# EasyEDA Pro project ProProject_AmaizeTrack.epro, schematic AmaizeSchematic_2

## Sheets
1 Schematic P1: Create Date: 2024-07-06; Page Name: Schematic P1; Project Name: AmaizeTrack; Schematic Name: AmaizeSchematic_2; Update Date: 2024-07-06; Company: AMAIZE; Drawed: Amaize; Page Size: A4; Part Number: #0001; Reviewed: Amaize; Version: V1.0
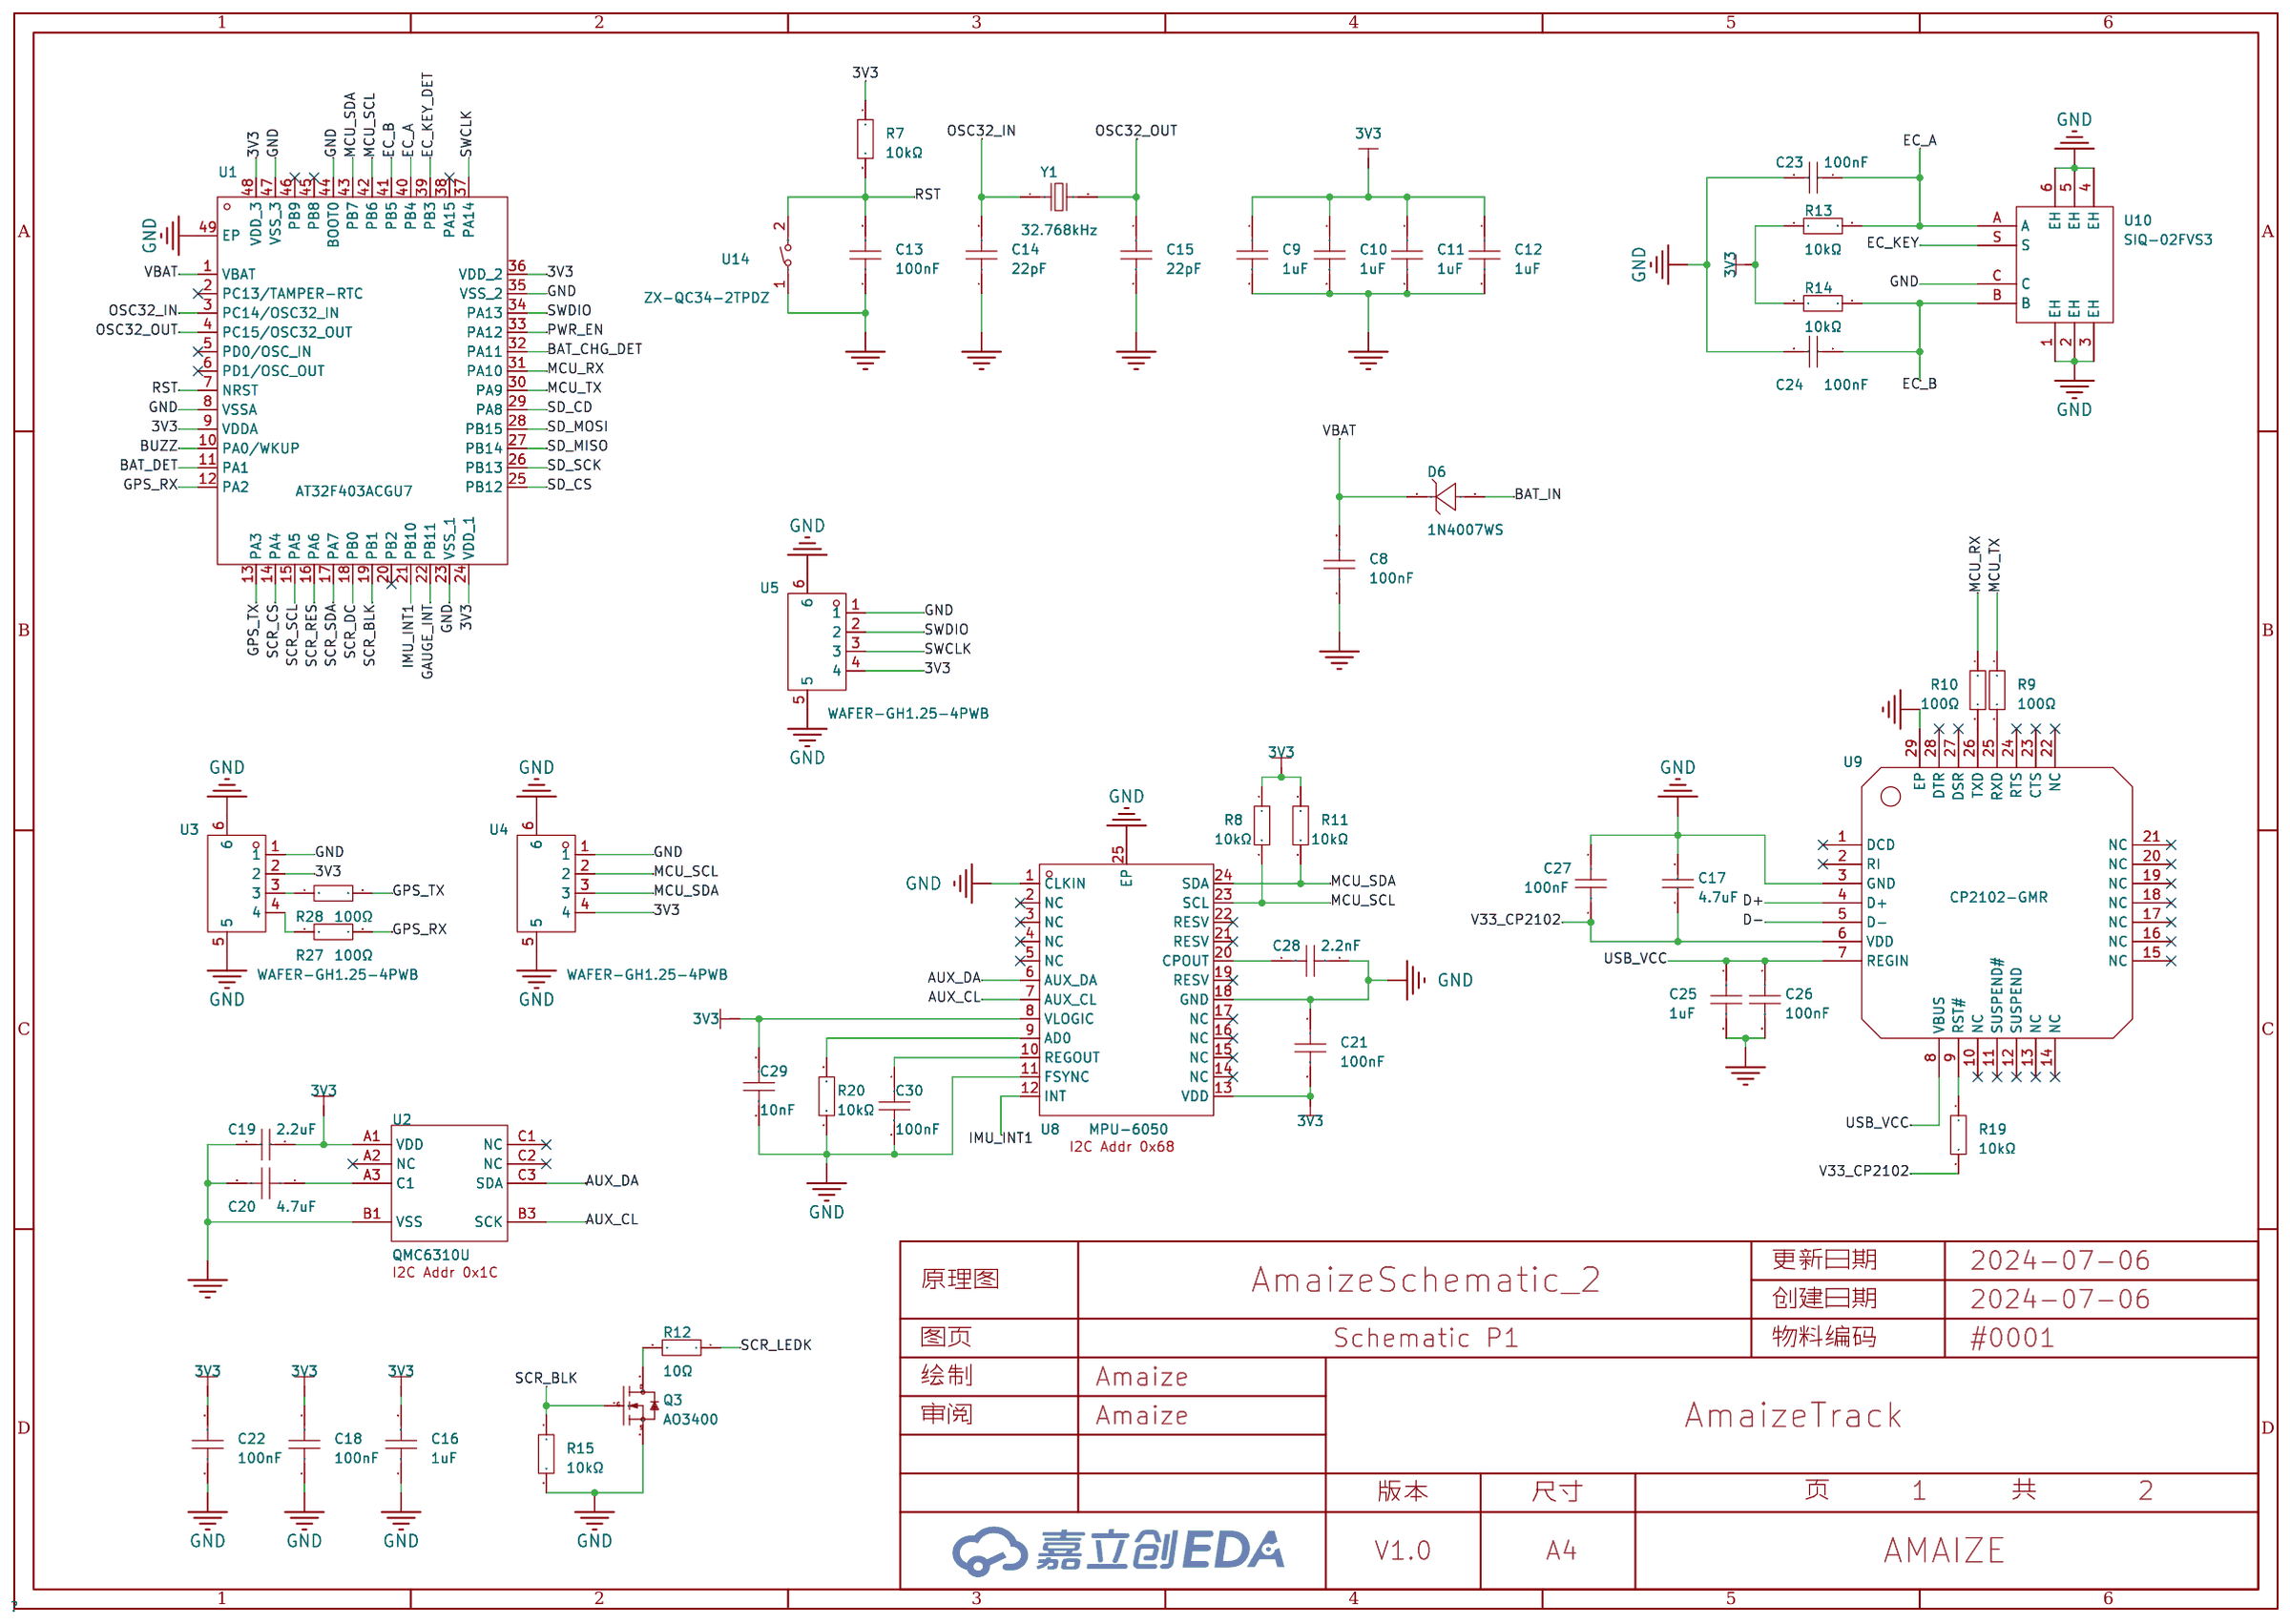
[diagram p2: Schematic P1]
2 Schematic P2: Page Name: Schematic P2; Company: Amaize; Version: 1.0
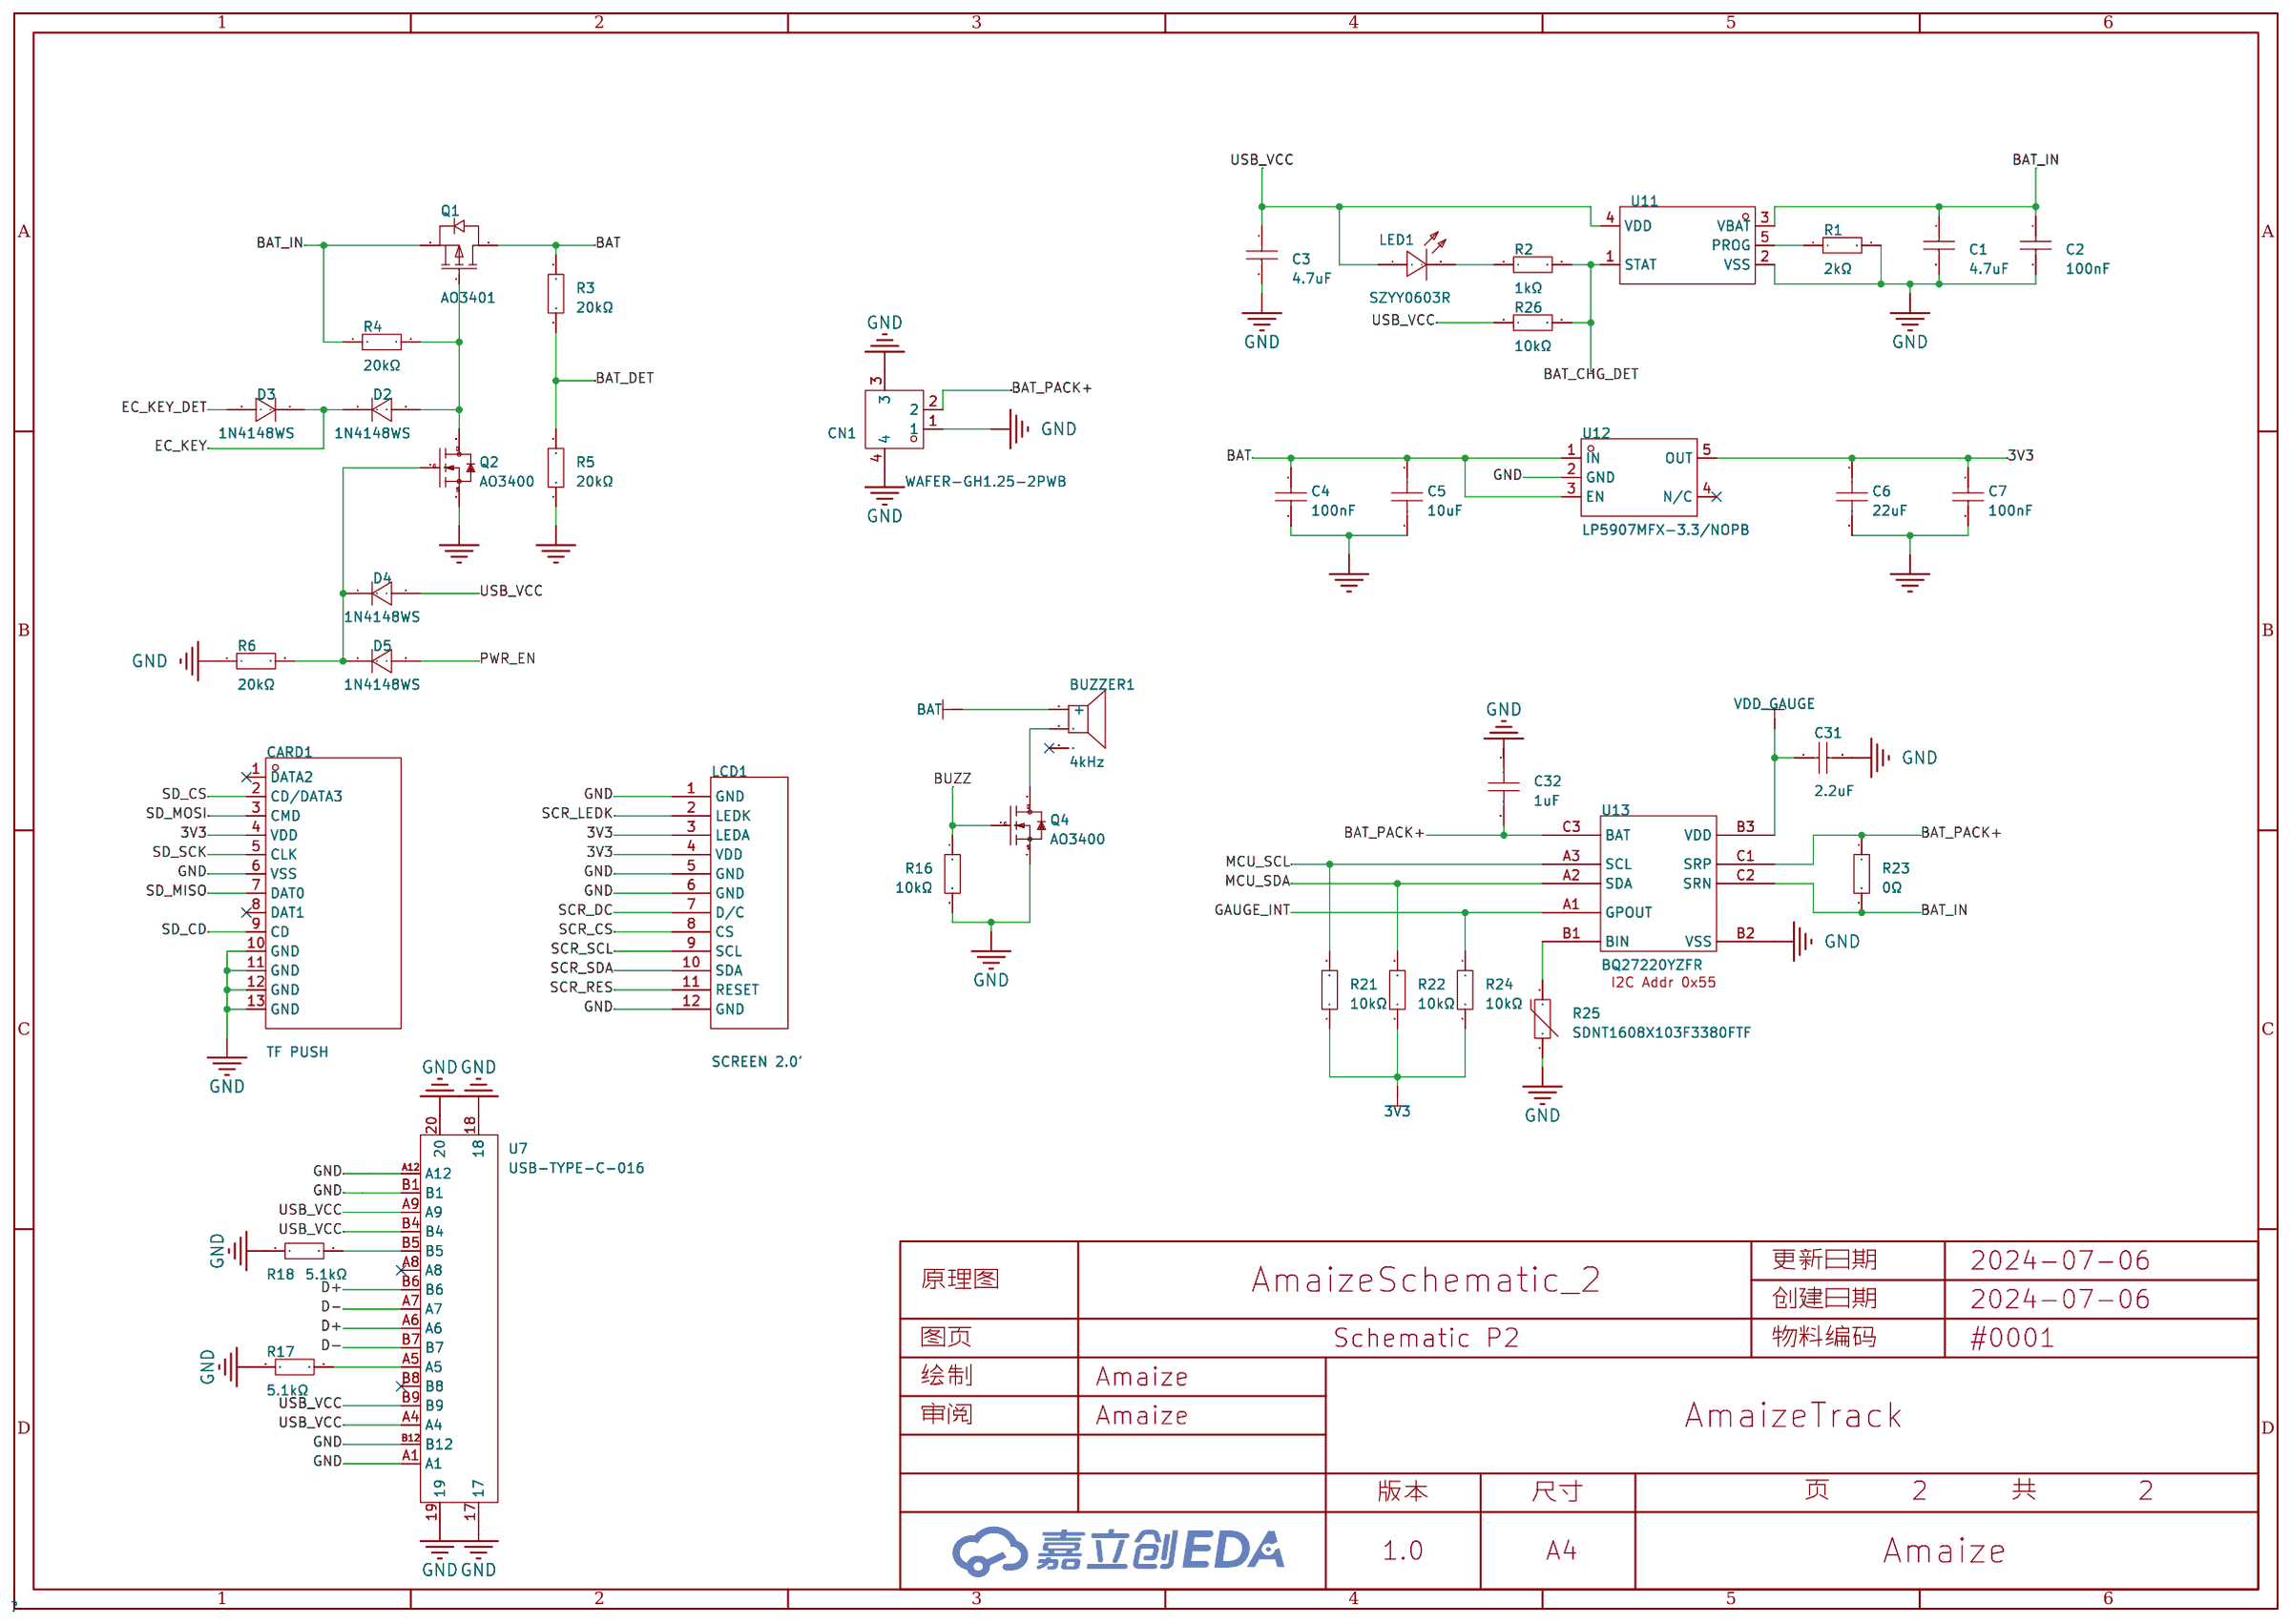
[diagram p3: Schematic P2]

## Parts
sheet Schematic P1
C8  100nF  [C0603]
C9  1uF  [C0603]
C10  1uF  [C0603]
C11  1uF  [C0603]
C12  1uF  [C0603]
C13  100nF  [C0603]
C14  22pF  [C0603]
C15  22pF  [C0603]
C16  1uF  [C0603]
C17  4.7uF  [C0603]
C18  100nF  [C0603]
C19  2.2uF  [C0603]
C20  4.7uF  [C0603]
C21  100nF  [C0603]
C22  100nF  [C0603]
C23  100nF  [C0603]
C24  100nF  [C0603]
C25  1uF  [C0603]
C26  100nF  [C0603]
C27  100nF  [C0603]
C28  2.2nF  [C0603]
C29  10nF  [C0603]
C30  100nF  [C0603]
D6  1N4007WS  [SOD-323_L1.8-W1.3-LS2.5-RD]
Q3  AO3400  [SOT-23-3_L2.9-W1.3-P1.90-LS2.4-BR]
R7  10kΩ  [R0603]
R8  10kΩ  [R0603]
R9  100Ω  [R0603]
R10  100Ω  [R0603]
R11  10kΩ  [R0603]
R12  10Ω  [R0603]
R13  10kΩ  [R0603]
R14  10kΩ  [R0603]
R15  10kΩ  [R0603]
R19  10kΩ  [R0603]
R20  10kΩ  [R0603]
R27  100Ω  [R0603]
R28  100Ω  [R0603]
U1  AT32F403ACGU7  [QFN-48_L6.0-W6.0-P0.40-BL-EP4.2]
U2  QMC6310U  [LGA-8_L1.2-W1.2-P0.40-R3-C3-TL]
U3  WAFER-GH1.25-4PWB  [CONN-SMD_4P-P1.25_XUNPU_WAFER-GH1.25-4PWB]
U4  WAFER-GH1.25-4PWB  [CONN-SMD_4P-P1.25_XUNPU_WAFER-GH1.25-4PWB]
U5  WAFER-GH1.25-4PWB  [CONN-SMD_4P-P1.25_XUNPU_WAFER-GH1.25-4PWB]
U8  MPU-6050  [QFN-24_L4.0-W4.0-P0.50-BL-EP2.7]
U9  CP2102-GMR  [WQFN-28_L5.0-W5.0-P0.50-BL-EP3.2]
U10  SIQ-02FVS3  [SW-SMD_SIQ-02FVS3_1]
U14  ZX-QC34-2TPDZ  [KEY-SMD_L3.9-W3.0-LS5.0-EH]
Y1  32.768kHz  [FC-135R_L3.2-W1.5]
sheet Schematic P2
BUZZER1  4kHz  [BUZ-SMD_FST-5030]
C1  4.7uF  [C0603]
C2  100nF  [C0603]
C3  4.7uF  [C0603]
C4  100nF  [C0603]
C5  10uF  [C0603]
C6  22uF  [C1206]
C7  100nF  [C0603]
C31  2.2uF  [C0603]
C32  1uF  [C0603]
CARD1  TF PUSH  [TF-SMD_TF-PUSH]
CN1  WAFER-GH1.25-2PWB  [CONN-TH_2P-P1.25_XUNPU_WAFER-GH1.25-2PWB]
D2  1N4148WS  [SOD-323_L1.8-W1.3-LS2.5-RD]
D3  1N4148WS  [SOD-323_L1.8-W1.3-LS2.5-RD]
D4  1N4148WS  [SOD-323_L1.8-W1.3-LS2.5-RD]
D5  1N4148WS  [SOD-323_L1.8-W1.3-LS2.5-RD]
LCD1  SCREEN 2.0'  [SCREEN 2.0' 12PIN]
LED1  SZYY0603R  [LED0603-R-RD]
Q1  AO3401  [SOT-23-3_L2.9-W1.4-P1.90-LS2.6-BR]
Q2  AO3400  [SOT-23-3_L2.9-W1.3-P1.90-LS2.4-BR]
Q4  AO3400  [SOT-23-3_L2.9-W1.3-P1.90-LS2.4-BR]
R1  2kΩ  [R0603]
R2  1kΩ  [R0603]
R3  20kΩ  [R0603]
R4  20kΩ  [R0603]
R5  20kΩ  [R0603]
R6  20kΩ  [R0603]
R16  10kΩ  [R0603]
R17  5.1kΩ  [R0603]
R18  5.1kΩ  [R0603]
R21  10kΩ  [R0603]
R22  10kΩ  [R0603]
R23  0Ω  [R2512]
R24  10kΩ  [R0603]
R25  SDNT1608X103F3380FTF  [R0603]
R26  10kΩ  [R0603]
U7  USB-TYPE-C-016  [USB-SMD_TYPE-C16PCB1.6073]
U11  MCP73831T-2ACI/OT  [SOT-23-5_L3.0-W1.7-P0.95-LS2.8-BL]
U12  LP5907MFX-3.3/NOPB  [SOT-23-5_L3.0-W1.7-P0.95-LS2.8-BR]
U13  BQ27220YZFR  [DSBGA-9_L1.7-W1.6-R3-C3-P0.50-BL]

## Library data of the parts
C2 C4 C7 C8 C13 C18 C21-C24 C26 C27 C30 = CC0603KRX7R9BB104: 容值:100nF;精度:±10%;额定电压:50V;材质(温度系数):X7R;; LCSC Part Name: 100nF ±10% 50V; Supplier Part: C14663; Manufacturer: YAGEO(国巨); Supplier Footprint: 0603; JLCPCB Part Class: Basic Part; Datasheet: https://atta.szlcsc.com/upload/public/pdf/source/20180910/C282072_33301C7F631E79921B82A8DAC6BCC5B3.pdf; Supplier: LCSC; Tolerance: ±10%; Voltage Rated: 50V; Temperature Coefficient: X7R
C9-C12 C16 C25 C32 = CC0603KRX5R9BB105: 容值:1uF;精度:±10%;额定电压:50V;材质(温度系数):X5R;; LCSC Part Name: 1uF ±10% 50V; Supplier Part: C128624; Manufacturer: YAGEO(国巨); Supplier Footprint: 0603; JLCPCB Part Class: Extended Part; Datasheet: https://atta.szlcsc.com/upload/public/pdf/source/20200814/C576840_DA45DE962A74012E2DAEDF1935E384ED.pdf; Supplier: LCSC; Tolerance: ±10%; Voltage Rated: 50V; Temperature Coefficient: X5R
C14 C15 = CC0603JRNPO9BN220: 容值:22pF;精度:±5%;额定电压:50V;材质(温度系数):NP0;; LCSC Part Name: 22pF ±5% 50V; Supplier Part: C105620; Manufacturer: YAGEO(国巨); Supplier Footprint: 0603; JLCPCB Part Class: Extended Part; Datasheet: https://atta.szlcsc.com/upload/public/pdf/source/20170505/1493957838062.pdf; Supplier: LCSC; Tolerance: ±5%; Voltage Rated: 50V; Temperature Coefficient: NP0
C1 C3 C17 C20 = CC0603KRX5R7BB475: 容值:4.7uF;精度:±10%;额定电压:16V;材质(温度系数):X5R;; LCSC Part Name: 4.7uF ±10% 16V; Supplier Part: C277476; Manufacturer: YAGEO(国巨); Supplier Footprint: 0603; JLCPCB Part Class: Extended Part; Datasheet: https://atta.szlcsc.com/upload/public/pdf/source/20181008/C309506_01C87B2C86DBD1236B532041A9B60642.pdf; Supplier: LCSC; Tolerance: ±10%; Voltage Rated: 16V; Temperature Coefficient: X5R
C19 C31 = CC0603KRX5R7BB225: 容值:2.2uF;精度:±10%;额定电压:16V;材质(温度系数):X5R;; LCSC Part Name: 2.2uF ±10% 16V; Supplier Part: C106853; Manufacturer: YAGEO(国巨); Supplier Footprint: 0603; JLCPCB Part Class: Extended Part; Datasheet: https://atta.szlcsc.com/upload/public/pdf/source/20181008/C309506_01C87B2C86DBD1236B532041A9B60642.pdf; Supplier: LCSC; Tolerance: ±10%; Voltage Rated: 16V; Temperature Coefficient: X5R
C28 = CC0603KRX7R9BB222: 容值:2.2nF;精度:±10%;额定电压:50V;材质(温度系数):X7R;; LCSC Part Name: 2.2nF ±10% 50V; Supplier Part: C107082; Manufacturer: YAGEO(国巨); Supplier Footprint: 0603; JLCPCB Part Class: Extended Part; Datasheet: https://atta.szlcsc.com/upload/public/pdf/source/20180910/C282072_33301C7F631E79921B82A8DAC6BCC5B3.pdf; Supplier: LCSC; Tolerance: ±10%; Voltage Rated: 50V; Temperature Coefficient: X7R
C29 = CC0603KRX7R9BB103: 容值:10nF;精度:±10%;额定电压:50V;材质(温度系数):X7R;; LCSC Part Name: 10nF ±10% 50V; Supplier Part: C100042; Manufacturer: YAGEO(国巨); Supplier Footprint: 0603; JLCPCB Part Class: Extended Part; Datasheet: https://atta.szlcsc.com/upload/public/pdf/source/20181008/C309510_22F155564471FAF6A489F7D68F34234E.pdf; Supplier: LCSC; Tolerance: ±10%; Voltage Rated: 50V; Temperature Coefficient: X7R
D6 = 1N4007WS: 二极管配置:独立式;正向压降(Vf):1.1V@1A;直流反向耐压(Vr):1kV;整流电流:1A;; LCSC Part Name: 电压:1kV 电流:1A; Supplier Part: C193404; Manufacturer: MDD(辰达半导体); Supplier Footprint: SOD-323; JLCPCB Part Class: Extended Part; Datasheet: https://atta.szlcsc.com/upload/public/pdf/source/20230823/865291948DF6557226235927F2F58F05.pdf; Supplier: LCSC; Diode Configuration: 独立式; Forward Voltage (Vf@If): 1.1V@1A; Reverse Voltage (Vr): 1kV; Average Rectified Current (Io): 1A; Reverse Leakage Current: 5uA@1kV; Rectified Current: 1A
Q2-Q4 = AO3400_C181090: 类型:1个N沟道;漏源电压(Vdss):30V;连续漏极电流(Id):5.8A;功率(Pd):350mW;导通电阻(RDS(on)@Vgs,Id):35mΩ@10V,5.8A;阈值电压(Vgs(th)@Id):1.4V@250uA;; LCSC Part Name: 1个N沟道 耐压:30V 电流:5.8A; Supplier Part: C181090; Manufacturer: Hottech(合科泰); Supplier Footprint: SOT-23; JLCPCB Part Class: Extended Part; Datasheet: https://atta.szlcsc.com/upload/public/pdf/source/20220427/6A3871894567E8883DB64081D5FF8011.pdf; Supplier: LCSC; Type: 1个N沟道; Drain Source Voltage (Vdss): 30V; Continuous Drain Current (Id): 5.8A; Power Dissipation (Pd): 350mW; Drain Source On Resistance (RDS(on)@Vgs,Id): 35mΩ@10V,5.8A; Gate Threshold Voltage (Vgs(th)@Id): 1.4V@250uA
R7 R8 R11 R13-R16 R19-R22 R24 R26 = 0603WAF1002T5E: 电阻类型:厚膜电阻;阻值:10kΩ;精度:±1%;功率:100mW;最大工作电压:75V;温度系数:±100ppm/℃;; LCSC Part Name: 厚膜电阻 10kΩ ±1% 100mW; Supplier Part: C25804; Manufacturer: UNI-ROYAL(厚声); Supplier Footprint: 0603; JLCPCB Part Class: Basic Part; Datasheet: https://atta.szlcsc.com/upload/public/pdf/source/20200306/C422600_1E6D84923E4A46A82E41ADD87F860B5C.pdf; Supplier: LCSC; Type: 厚膜电阻; Tolerance: ±1%; Power(Watts): 100mW; Overload Voltage (Max): 75V; Temperature Coefficient: ±100ppm/℃; Operating Temperature Range: -55℃~+155℃
R9 R10 R27 R28 = 0603WAF1000T5E: 电阻类型:厚膜电阻;阻值:100Ω;精度:±1%;功率:100mW;最大工作电压:75V;温度系数:±200ppm/℃;; LCSC Part Name: 100Ω ±1% 100mW 厚膜电阻; Supplier Part: C22775; Manufacturer: UNI-ROYAL(厚声); Supplier Footprint: 0603; JLCPCB Part Class: Basic Part; Datasheet: https://atta.szlcsc.com/upload/public/pdf/source/20200306/C422600_1E6D84923E4A46A82E41ADD87F860B5C.pdf; Supplier: LCSC; Type: 厚膜电阻; Tolerance: ±1%; Power(Watts): 100mW; Overload Voltage (Max): 75V; Temperature Coefficient: ±200ppm/℃; Operating Temperature Range: -55℃~+155℃
R12 = 0603WAF100JT5E: 电阻类型:厚膜电阻;阻值:10Ω;精度:±1%;功率:100mW;最大工作电压:75V;温度系数:±400ppm/℃;; LCSC Part Name: 10Ω ±1% 100mW 厚膜电阻; Supplier Part: C22859; Manufacturer: UNI-ROYAL(厚声); Supplier Footprint: 0603; JLCPCB Part Class: Basic Part; Datasheet: https://atta.szlcsc.com/upload/public/pdf/source/20200306/C422600_1E6D84923E4A46A82E41ADD87F860B5C.pdf; Supplier: LCSC; Type: 厚膜电阻; Tolerance: ±1%; Power(Watts): 100mW; Overload Voltage (Max): 75V; Temperature Coefficient: ±400ppm/℃; Operating Temperature Range: -55℃~+155℃
U1 = AT32F403ACGU7: 频率 (MHz)：240，FLASH (KB)：1024，SRAM (KB)：224，CPU：ARM? Cortex?-M4，工作电压（V）：2.6~3.6，工作温度：-40°C ~ 105°C，封装：QFN48; LCSC Part Name: 基于ARM® 32位的Cortex®-M4F微控制器+FPU，带256 K字节至1024 K字节内部闪存、sLib、USB、17个定时器、3个ADC、20个通信接口; Supplier Part: C528438; Manufacturer: ARTERY(雅特力); Supplier Footprint: QFN-48-EP(6x6); JLCPCB Part Class: 扩展库; Datasheet: https://atta.szlcsc.com/upload/public/pdf/source/20200507/C528435_60E4F7A933572380D38CD1507797F883.pdf; Supplier: LCSC
U2 = QMC6310U: 地磁传感器M-sensor，2.5~3.3V, 16 Bit ADC,量程±30 Gauss，I2C; LCSC Part Name: 三轴磁传感器 停产; Supplier Part: C669299; Manufacturer: QST(上海矽睿); Supplier Footprint: LGA-8(1.2x1.2); JLCPCB Part Class: 扩展库; Datasheet: https://atta.szlcsc.com/upload/public/pdf/source/20200701/C669299_4808D050935A658304D88D676A7B6DC2.pdf; Supplier: LCSC
U3-U5 = WAFER-GH1.25-4PWB: 插针结构:1x4P;间距:1.25mm;安装方式:卧贴;参考系列:GH;总PIN数:4P;排数:1;每排PIN数:4;额定电流:1A;工作温度范围:-25℃~+85℃;; LCSC Part Name: 1x4P 间距:1.25mm 卧贴 系列:GH; Supplier Part: C3029379; Manufacturer: XUNPU(讯普); Supplier Footprint: SMD,P=1.25mm,卧贴; JLCPCB Part Class: Extended Part; Datasheet: https://atta.szlcsc.com/upload/public/pdf/source/20220527/CB8773BFB0913C3B8ABD62CB38BA101A.pdf; Supplier: LCSC; Pins Structure: 1x4P; Pitch: 1.25mm; Mounting Style: 卧贴; Reference Series: GH; Number of Pins: 4P; Number of Rows: 1; Number of PINs Per Row: 4; Current Rating (Max): 1A; Operating Temperature Range: -25℃~+85℃
U8 = MPU-6050: 传感器类型:加速度计陀螺仪;; Supplier Part: C24112; Manufacturer: TDK InvenSense(应美盛); Supplier Footprint: QFN-24-EP(4x4); JLCPCB Part Class: 扩展库; Datasheet: https://atta.szlcsc.com/upload/public/pdf/source/20140425/1457707046159.pdf; Supplier: LCSC; Sensor Type: 加速度计陀螺仪; Operating Temperature: -40℃~+85℃
U9 = CP2102-GMR: 应用功能:收发器;接口协议:USB;数据速率:1Mbps;; Supplier Part: C6568; Manufacturer: SKYWORKS/SILICON LABS(芯科); Supplier Footprint: WQFN-28-EP(5x5); JLCPCB Part Class: Extended Part; Datasheet: https://atta.szlcsc.com/upload/public/pdf/source/20170103/1483439882795.pdf; Supplier: LCSC; Applications Function: 收发器; Protocol: USB; Supply Voltage: 3V~3.6V; Data Rate: 1Mbps; Type: Transceiver; Number of Drivers/Receivers: 1/1
U10 = SIQ-02FVS3: LCSC Part Name: 拨轮滚轮旋转编码器开关; Supplier Part: C2925423; Manufacturer: MITSUMI(美上美); Supplier Footprint: SMD; JLCPCB Part Class: 扩展库; Datasheet: https://atta.szlcsc.com/upload/public/pdf/source/20220728/2FBC1A98A06DC86460FC69DAE20456FC.pdf; Supplier: LCSC
U14 = ZX-QC34-2TPDZ: 电路结构:单刀单掷;按钮形状:圆形按钮;作用力:2.6N;安装方式:立贴;开关长度:3mm;开关宽度:4mm;开关高度:2mm;带支架:不带;触点电流:50mA;额定电压(AC):250V;额定电压(DC):12V;绝缘电阻:100MΩ;机械寿命:10万次;; LCSC Part Name: 3*4*2贴片开关带柱; Supplier Part: C7470219; Manufacturer: Megastar(兆星); Supplier Footprint: SMD; JLCPCB Part Class: 扩展库; Datasheet: https://atta.szlcsc.com/upload/public/pdf/source/20230724/D2731FAADF93973E25928DE23F241F8A.pdf; Supplier: LCSC; Circuit: 单刀单掷; Actuator Style: 圆形按钮; Operating Force: 2.6N; Mounting Style: 立贴; Switch Length: 3mm; Switch Width: 4mm; Switch Height: 2mm; Strike Gundam: 不带; Contact Current: 50mA; Voltage Rating (AC): 250V; Voltage Rating (DC): 12V; Insulation Resistance: 100MΩ; Actuator/Cap Color: 黑色; Pin Style: 鸥翼型; Mechanical Life: 10万次; Operating Temperature: -30℃~+80℃
Y1 = Q13FC13500004_C32346: 晶振类型:贴片晶振;频率:32.768kHz;常温频差:±20ppm;外接负载电容:12.5pF;; LCSC Part Name: 32.768kHz ±20ppm 12.5pF; Supplier Part: C32346; Manufacturer: EPSON(爱普生); Manufacturer Part: Q13FC13500004; Supplier Footprint: SMD3215-2P; JLCPCB Part Class: 基础库; Datasheet: https://atta.szlcsc.com/upload/public/pdf/source/20240418/0E0FF5F0356BA3753F616001439D1416.pdf; Supplier: LCSC; Crystal Type: 贴片晶振; Normal temperature Frequency Tolerance: ±20ppm; External load capacitor: 12.5pF; Equivalent Series Resistance (ESR): 70kΩ; Operating Temperature: -40℃~+85℃
BUZZER1 = FUET-5030: 驱动方式:无源(外部驱动);构造类型:电磁式;频率:4kHz;声压(SPL):80dB@3V,10cm;; LCSC Part Name: 电压 3V 频率 4KHZ; Supplier Part: C391031; Manufacturer: FUET(福声科技); Supplier Footprint: SMD,5x5mm; JLCPCB Part Class: Extended Part; Datasheet: https://atta.szlcsc.com/upload/public/pdf/source/20191031/C391031_43FC1E3FF66CFCA41A5CF508A1DC7B47.pdf; Supplier: LCSC; Oscillator Circuit: 无源(外部驱动); Technology Type: 电磁式; Operating Voltage: 2V~4V; Sound Pressure Level (SPL): 80dB@3V,10cm; Length: 5mm; Width: 5mm; Height: 3.2mm
C5 = CC0603MRX5R8BB106: 容值:10uF;精度:±20%;额定电压:25V;材质(温度系数):X5R;; LCSC Part Name: 10uF ±20% 25V; Supplier Part: C596327; Manufacturer: YAGEO(国巨); Supplier Footprint: 0603; JLCPCB Part Class: Extended Part; Datasheet: https://atta.szlcsc.com/upload/public/pdf/source/20200609/C596327_17DF31B1E9B32F0BAA34398C136F635E.pdf; Supplier: LCSC; Tolerance: ±20%; Voltage Rated: 25V; Temperature Coefficient: X5R
C6 = CC1206KKX5R8BB226: 容值:22uF;精度:±10%;额定电压:25V;材质(温度系数):X5R;; LCSC Part Name: 22uF ±10% 25V; Supplier Part: C2178233; Manufacturer: YAGEO(国巨); Supplier Footprint: 1206; JLCPCB Part Class: Extended Part; Datasheet: https://atta.szlcsc.com/upload/public/pdf/source/20210721/C2178233_9332B0B48D57512C019C2BF300923A07.pdf; Supplier: LCSC; Tolerance: ±10%; Voltage Rated: 25V; Temperature Coefficient: X5R
CARD1 = TF PUSH: 卡连接方式:自弹式;卡类型:MicroSD卡(TF卡);连接器类型:卡座;本体最大高度:2mm;触头材质:-;触头镀层:-;工作温度范围:-20℃~+90℃;焊接温度(最大值):-;; LCSC Part Name: 自弹式 MicroSD卡(TF卡) 卡座; Supplier Part: C393941; Manufacturer: SHOU HAN(首韩); Supplier Footprint: SMD; JLCPCB Part Class: Extended Part; Datasheet: https://atta.szlcsc.com/upload/public/pdf/source/20191011/C393941_0DDD896EE907FEB750D8B7B8982E2A67.pdf; Supplier: LCSC; Card Connection Mode: 自弹式; Card Type: MicroSD卡(TF卡); Connector Type: 卡座; Maximum Body Height: 2mm; Operating Temperature Range: -20℃~+90℃; Additional Card Detection Pins: 无
CN1 = WAFER-GH1.25-2PWB: 插针结构:1x2P;间距:1.25mm;安装方式:卧贴;参考系列:GH;总PIN数:2P;排数:1;每排PIN数:2;额定电流:1A;工作温度范围:-25℃~+85℃;; LCSC Part Name: 1x2P 间距:1.25mm 卧贴 系列:GH; Supplier Part: C3029377; Manufacturer: XUNPU(讯普); Supplier Footprint: SMD,P=1.25mm,卧贴; JLCPCB Part Class: 扩展库; Datasheet: https://atta.szlcsc.com/upload/public/pdf/source/20220527/CB8773BFB0913C3B8ABD62CB38BA101A.pdf; Supplier: LCSC; Pins Structure: 1x2P; Pitch: 1.25mm; Mounting Style: 卧贴; Reference Series: GH; Number of Pins: 2P; Number of Rows: 1; Number of PINs Per Row: 2; Current Rating (Max): 1A; Operating Temperature Range: -25℃~+85℃
D2-D5 = 1N4148WS_C2128: 二极管配置:独立式;正向压降(Vf):1.25V@150mA;直流反向耐压(Vr):100V;平均整流电流(Io):150mA;功率:200mW;反向恢复时间(trr):4ns;; LCSC Part Name: 电压:100V 电流:150mA; Supplier Part: C2128; Manufacturer: CJ(江苏长电/长晶); Supplier Footprint: SOD-323; JLCPCB Part Class: 基础库; Datasheet: https://atta.szlcsc.com/upload/public/pdf/source/20140809/1457707208178.pdf; Supplier: LCSC; Diode Configuration: 独立式; Forward Voltage (Vf@If): 1.25V@150mA; Reverse Voltage (Vr): 100V; Average Rectified Current (Io): 150mA; Power Dissipation: 200mW; Reverse Leakage Current: 1uA@75V; Reverse Recovery Time (trr): 4ns
LCD1 = SCREEN 2.0&apos;: 2.0寸TFT IPS液晶显示屏 12PIN(焊接) 240x320 ST7789 SPI; Check: false; Standardization Check: false
LED1 = SZYY0603R: 发光颜色:红色;功率:40mW;正向电流:20mA;主波长:615nm~630nm;二极管配置:-;透镜颜色:无色透明透镜;色温:-;发光角度:120°;载带方式:-;工作温度:-40℃~+85℃;; LCSC Part Name: 红灯; Supplier Part: C434419; Manufacturer: yongyu(永裕光电); Supplier Footprint: 0603; JLCPCB Part Class: 扩展库; Datasheet: https://atta.szlcsc.com/upload/public/pdf/source/20191204/C434419_0B955C1F73FF88449D9A795B6FF49070.pdf; Supplier: LCSC; Emitted Color: 红色; Power Dissipation: 40mW; Forward Current: 20mA; Dominant Wavelength: 615nm~630nm; Peak Wavelength: 645nm; Lens Color: 无色透明透镜; Viewing Angle: 120°; Operating Temperature: -40℃~+85℃
Q1 = AO3401_C727156: 类型:1个P沟道;漏源电压(Vdss):30V;连续漏极电流(Id):4.2A;功率(Pd):350mW;导通电阻(RDS(on)@Vgs,Id):65mΩ@10V,4.2A;阈值电压(Vgs(th)@Id):1.3V@250uA;; LCSC Part Name: 1个P沟道 耐压:30V 电流:4.2A; Supplier Part: C727156; Manufacturer: TWGMC(台湾迪嘉); Supplier Footprint: SOT-23; JLCPCB Part Class: 扩展库; Datasheet: https://atta.szlcsc.com/upload/public/pdf/source/20200827/C727156_6E081BBEEFBC6B8FEE164CB196B0AF30.pdf; Supplier: LCSC; Type: 1个P沟道; Drain Source Voltage (Vdss): 30V; Continuous Drain Current (Id): 4.2A; Power Dissipation (Pd): 350mW; Drain Source On Resistance (RDS(on)@Vgs,Id): 65mΩ@10V,4.2A; Gate Threshold Voltage (Vgs(th)@Id): 1.3V@250uA
R1 = 0603WAF2001T5E: 电阻类型:厚膜电阻;阻值:2kΩ;精度:±1%;功率:100mW;最大工作电压:75V;温度系数:±100ppm/℃;; LCSC Part Name: 2kΩ ±1% 100mW 厚膜电阻; Supplier Part: C22975; Manufacturer: UNI-ROYAL(厚声); Supplier Footprint: 0603; JLCPCB Part Class: Basic Part; Datasheet: https://atta.szlcsc.com/upload/public/pdf/source/20200306/C422600_1E6D84923E4A46A82E41ADD87F860B5C.pdf; Supplier: LCSC; Type: 厚膜电阻; Tolerance: ±1%; Power(Watts): 100mW; Overload Voltage (Max): 75V; Temperature Coefficient: ±100ppm/℃; Operating Temperature Range: -55℃~+155℃
R2 = 0603WAF1001T5E: 电阻类型:厚膜电阻;阻值:1kΩ;精度:±1%;功率:100mW;最大工作电压:75V;温度系数:±100ppm/℃;; LCSC Part Name: 1kΩ ±1% 100mW 厚膜电阻; Supplier Part: C21190; Manufacturer: UNI-ROYAL(厚声); Supplier Footprint: 0603; JLCPCB Part Class: Basic Part; Datasheet: https://atta.szlcsc.com/upload/public/pdf/source/20200306/C422600_1E6D84923E4A46A82E41ADD87F860B5C.pdf; Supplier: LCSC; Type: 厚膜电阻; Tolerance: ±1%; Power(Watts): 100mW; Overload Voltage (Max): 75V; Temperature Coefficient: ±100ppm/℃; Operating Temperature Range: -55℃~+155℃
R3-R6 = 0603WAF2002T5E: 电阻类型:厚膜电阻;阻值:20kΩ;精度:±1%;功率:100mW;最大工作电压:75V;温度系数:±100ppm/℃;; LCSC Part Name: 20kΩ ±1% 100mW 厚膜电阻; Supplier Part: C4184; Manufacturer: UNI-ROYAL(厚声); Supplier Footprint: 0603; JLCPCB Part Class: Basic Part; Datasheet: https://atta.szlcsc.com/upload/public/pdf/source/20200306/C422600_1E6D84923E4A46A82E41ADD87F860B5C.pdf; Supplier: LCSC; Type: 厚膜电阻; Tolerance: ±1%; Power(Watts): 100mW; Overload Voltage (Max): 75V; Temperature Coefficient: ±100ppm/℃; Operating Temperature Range: -55℃~+155℃
R17 R18 = 0603WAF5101T5E: 电阻类型:厚膜电阻;阻值:5.1kΩ;精度:±1%;功率:100mW;最大工作电压:75V;温度系数:±100ppm/℃;; LCSC Part Name: 5.1kΩ ±1% 100mW 厚膜电阻; Supplier Part: C23186; Manufacturer: UNI-ROYAL(厚声); Supplier Footprint: 0603; JLCPCB Part Class: Basic Part; Datasheet: https://atta.szlcsc.com/upload/public/pdf/source/20200306/C422600_1E6D84923E4A46A82E41ADD87F860B5C.pdf; Supplier: LCSC; Type: 厚膜电阻; Tolerance: ±1%; Power(Watts): 100mW; Overload Voltage (Max): 75V; Temperature Coefficient: ±100ppm/℃; Operating Temperature Range: -55℃~+155℃
R23 = 25121WF0000T4E: 电阻类型:厚膜电阻;阻值:0Ω;精度:±1%;功率:1W;最大工作电压:200V;温度系数:±800ppm/℃;; LCSC Part Name: 0Ω ±1% 1W 厚膜电阻; Supplier Part: C270957; Manufacturer: UNI-ROYAL(厚声); Supplier Footprint: 2512; JLCPCB Part Class: Extended Part; Datasheet: https://atta.szlcsc.com/upload/public/pdf/source/20200306/C422600_1E6D84923E4A46A82E41ADD87F860B5C.pdf; Supplier: LCSC; Type: 厚膜电阻; Tolerance: ±1%; Power(Watts): 1W; Overload Voltage (Max): 200V; Temperature Coefficient: ±800ppm/℃; Operating Temperature Range: -55℃~+155℃
R25 = SDNT1608X103F3380FTF: 阻值(25℃):10kΩ;B值(25℃/50℃):3380K;电阻精度:±1%;功率:100mW;B值精度:±1%;最大稳态电流(25℃):310uA;; LCSC Part Name: 10kΩ 电阻精度:±1% 3380K; Supplier Part: C316397; Manufacturer: Sunlord(顺络); Supplier Footprint: 0603; JLCPCB Part Class: Extended Part; Datasheet: https://atta.szlcsc.com/upload/public/pdf/source/20210916/BF106A3565EDFEB141CB3E0EA3A661F8.pdf; Supplier: LCSC; Resistance @ 25℃: 10kΩ; B Constant (25℃/50℃): 3380K; Resistance Tolerance: ±1%; Power: 100mW; B Constant Tolerance: ±1%; Steady State Current (Max): 310uA; Operating Temperature: -55℃~+125℃
U7 = USB-TYPE-C-016: 连接器类型:Type-C;标准:-;公母:母;端口数量:1;触点数量:16P;安装方式:沉板;额定电流 - 电源:3A;工作温度范围:-25℃~+85℃;; LCSC Part Name: Type-C 母 沉板; Supplier Part: C2927036; Manufacturer: DEALON(德艺隆); Supplier Footprint: SMD; JLCPCB Part Class: 扩展库; Datasheet: https://atta.szlcsc.com/upload/public/pdf/source/20211217/5E0367F8DDF5AA2E37AE5029F1BD8FBF.pdf; Supplier: LCSC; Connector Type: Type-C; Gender: 母; Number of Ports: 1; Number of Contacts: 16P; Mounting Style: 沉板; Current Rating - Power (Max): 3A; Operating Temperature Range: -25℃~+85℃
U11 = MCP73831T-2ACI/OT: 电源电压:6V;最大充电电流:500mA;电池类型:锂离子/聚合物;电池节数:1;; Supplier Part: C424093; Manufacturer: MICROCHIP(美国微芯); Supplier Footprint: SOT-23-5; JLCPCB Part Class: Extended Part; Datasheet: https://atta.szlcsc.com/upload/public/pdf/source/20190902/C424093_BB3CBFD6F009A8554318004A07DA97EE.pdf; Supplier: LCSC; Supply Voltage: 6V; Maximum Charge Current: 500mA; Type of Battery: 锂离子/聚合物; Number of Cells: 1; Operating Temperature: -40℃~+85℃
U12 = LP5907MFX-3.3/NOPB: 输出类型:固定;最大输入电压:5.5V;输出电压:3.3V;最大输出电流:250mA;电源纹波抑制比(PSRR):90dB;输出极性:正极;; LCSC Part Name: 输入5.5V 输出3.3V 250mA; Supplier Part: C80670; Manufacturer: TI(德州仪器); Supplier Footprint: SOT-23-5; JLCPCB Part Class: 扩展库; Datasheet: https://www.ti.com/cn/lit/gpn/lp5907; Supplier: LCSC; Output Type: 固定; Maximum Input Voltage: 5.5V; Output Voltage: 3.3V; MAX Output Current: 250mA; Power Supply Rejection Ratio (PSRR): 90dB; Dropout Voltage: 250mV@(250mA); standby current: 25uA; Operating Temperature: -40℃~+125℃; Output Polarity: 正极; Number of Outputs: 1
U13 = BQ27220YZFR: 电池类型:锂离子/聚合物;电池节数:1;; Supplier Part: C528617; Manufacturer: TI(德州仪器); Supplier Footprint: DSBGA-9; JLCPCB Part Class: 扩展库; Datasheet: https://www.ti.com/cn/lit/gpn/bq27220; Supplier: LCSC; The Chip Type: 电池监测芯片; Type of Battery: 锂离子/聚合物; Number of Cells: 1; Operating Temperature: -40℃~+85℃

## Nets
3V3: C6.1 C7.1 C9.1 C10.1 C11.1 C12.1 C16.2 C18.2 C19.2 C21.2 C22.2 C29.2 CARD1.4(VDD) LCD1.3(LEDA) LCD1.4(VDD) R7.1 R8.1 R11.1 R13.1 R14.1 R21.1 R22.1 R24.2 U1.9(VDDA) U1.24(VDD_1) U1.36(VDD_2) U1.48(VDD_3) U2.A1(VDD) U3.2 U4.4 U5.4 U8.8(VLOGIC) U8.13(VDD) U12.5(OUT)
GND: C1.2 C2.2 C3.2 C4.2 C5.2 C6.2 C7.2 C8.1 C9.2 C10.2 C11.2 C12.2 C13.1 C14.1 C15.2 C16.1 C17.1 C18.1 C19.1 C20.2 C21.1 C22.1 C23.2 C24.2 C25.2 C26.2 C27.1 C28.2 C29.1 C30.2 C31.2 C32.1 CARD1.6(VSS) CARD1.10(GND) CARD1.11(GND) CARD1.12(GND) CARD1.13(GND) CN1.1 CN1.3 CN1.4 LCD1.1(GND) LCD1.5(GND) LCD1.6(GND) LCD1.12(GND) Q2.2(S) Q3.2(S) Q4.2(S) R1.2 R5.2 R6.1 R15.2 R16.2 R17.1 R18.1 R20.1 R25.2 U1.8(VSSA) U1.23(VSS_1) U1.35(VSS_2) U1.44(BOOT0) U1.47(VSS_3) U1.49(EP) U2.B1(VSS) U3.1 U3.5 U3.6 U4.1 U4.5 U4.6 U5.1 U5.5 U5.6 U7.17 U7.18 U7.19 U7.20 U7.A1 U7.A12 U7.B1 U7.B12 U8.1(CLKIN) U8.11(FSYNC) U8.18(GND) U8.25(EP) U9.3(GND) U9.29(EP) U10.1(EH) U10.2(EH) U10.3(EH) U10.4(EH) U10.5(EH) U10.6(EH) U10.C U11.2(VSS) U12.2(GND) U13.B2(VSS) U14.1
V33_CP2102: C17.2 C27.2 R19.2 U9.6(VDD)
VBAT: C8.2 D6.1(K) U1.1(VBAT)
VDD_GAUGE: C31.1 U13.B3(VDD)
AUX_CL: U2.B3(SCK) U8.7(AUX_CL)
AUX_DA: U2.C3(SDA) U8.6(AUX_DA)
BAT: BUZZER1.1(+) C4.1 C5.1 Q1.3(D) R3.1 U12.1(IN) U12.3(EN)
BAT_CHG_DET: R2.2 R26.2 U1.32(PA11) U11.1(STAT)
BAT_DET: R3.2 R5.1 U1.11(PA1)
BAT_IN: C1.1 C2.1 D6.2(A) Q1.2(S) R4.1 R23.2 U11.3(VBAT) U13.C2(SRN)
BAT_PACK+: C32.2 CN1.2 R23.1 U13.C1(SRP) U13.C3(BAT)
BUZZ: Q4.1(G) R16.1 U1.10(PA0/WKUP)
D+: U7.A6 U7.B6 U9.4(D+)
D-: U7.A7 U7.B7 U9.5(D-)
EC_A: C23.1 R13.2 U1.40(PB4) U10.A
EC_B: C24.1 R14.2 U1.41(PB5) U10.B
EC_KEY: D2.1(K) D3.1(K) U10.S
EC_KEY_DET: D3.2(A) U1.39(PB3)
GAUGE_INT: R24.1 U1.22(PB11) U13.A1(GPOUT)
GPS_RX: R27.2 U1.12(PA2)
GPS_TX: R28.2 U1.13(PA3)
IMU_INT1: U1.21(PB10) U8.12(INT)
MCU_RX: R10.1 U1.31(PA10)
MCU_SCL: R8.2 R21.2 U1.42(PB6) U4.2 U8.23(SCL) U13.A3(SCL)
MCU_SDA: R11.2 R22.2 U1.43(PB7) U4.3 U8.24(SDA) U13.A2(SDA)
MCU_TX: R9.1 U1.30(PA9)
OSC32_IN: C14.2 U1.3(PC14/OSC32_IN) Y1.1
OSC32_OUT: C15.1 U1.4(PC15/OSC32_OUT) Y1.2
PWR_EN: D5.2(A) U1.33(PA12)
RST: C13.2 R7.2 U1.7(NRST) U14.2
SCR_BLK: Q3.1(G) R15.1 U1.19(PB1)
SCR_CS: LCD1.8(CS) U1.14(PA4)
SCR_DC: LCD1.7(D/C) U1.18(PB0)
SCR_LEDK: LCD1.2(LEDK) R12.1
SCR_RES: LCD1.11(RESET) U1.16(PA6)
SCR_SCL: LCD1.9(SCL) U1.15(PA5)
SCR_SDA: LCD1.10(SDA) U1.17(PA7)
SD_CD: CARD1.9(CD) U1.29(PA8)
SD_CS: CARD1.2(CD/DATA3) U1.25(PB12)
SD_MISO: CARD1.7(DAT0) U1.27(PB14)
SD_MOSI: CARD1.3(CMD) U1.28(PB15)
SD_SCK: CARD1.5(CLK) U1.26(PB13)
SWCLK: U1.37(PA14) U5.3
SWDIO: U1.34(PA13) U5.2
USB_VCC: C3.1 C25.1 C26.1 D4.2(A) LED1.1(+) R26.1 U7.A4 U7.A9 U7.B4 U7.B9 U9.7(REGIN) U9.8(VBUS) U11.4(VDD)
$1N4620: C20.1 U2.A3(C1)
$1N6394: Q3.3(D) R12.2
$1N8215: C28.1 U8.20(CPOUT)
$1N9459: R19.1 U9.9(RST#)
$1N9734: R10.2 U9.26(TXD)
$1N9736: R9.2 U9.25(RXD)
$1N17722: C30.1 U8.10(REGOUT)
$1N17759: R20.2 U8.9(AD0)
$1N48758: R27.1 U3.4
$1N48760: R28.1 U3.3
$2N665: D2.2(A) Q1.1(G) Q2.3(D) R4.2
$2N875: D4.1(K) D5.1(K) Q2.1(G) R6.2
$2N1939: LED1.2(-) R2.1
$2N1957: R1.1 U11.5(PROG)
$2N3420: R25.1 U13.B1(BIN)
$2N9095: R17.2 U7.A5
$2N9100: R18.2 U7.B5
$2N16866: BUZZER1.2 Q4.3(D)

Not connected (* = marked no-connect by the designer): BUZZER1 3*; CARD1 1(DATA2)* 8(DAT1)*; U1 2(PC13/TAMPER-RTC)* 5(PD0/OSC_IN)* 6(PD1/OSC_OUT)* 20(PB2)* 38(PA15)* 45(PB8)* 46(PB9)*; U2 A2(NC)* C1(NC)* C2(NC)*; U7 A8* B8*; U8 2(NC)* 3(NC)* 4(NC)* 5(NC)* 14(NC)* 15(NC)* 16(NC)* 17(NC)* 19(RESV)* 21(RESV)* 22(RESV)*; U9 1(DCD)* 2(RI)* 10(NC)* 11(SUSPEND#)* 12(SUSPEND)* 13(NC)* 14(NC)* 15(NC)* 16(NC)* 17(NC)* 18(NC)* 19(NC)* 20(NC)* 21(NC)* 22(NC)* 23(CTS)* 24(RTS)* 27(DSR)* 28(DTR)*; U12 4(N/C)*

## Notes on the sheets
sheet 1
- I2C Addr 0x68
- I2C Addr 0x1C
sheet 2
- I2C Addr 0x55
